# EAGLE design Screw Terminal (EAGLE 5.10)
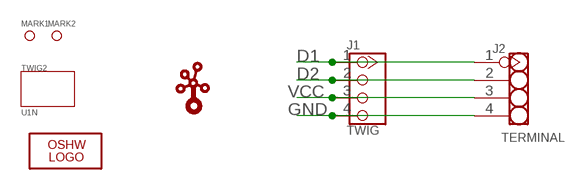
[diagram p0: schematic, sheet 1]

## Parts
J1  TWIG  TWIG-2.0-LEADED-2.0  [4P-LEADED-2.0]
J2  TERMINAL  TERMINAL-3.5X4  [4P-3.5]
LOGO1  LOGO-OSHW-FILLX0150-NT  [OSHW_FILLX150_NOTEXT]
MARK1  PAD-MARK  [ROUND-MARK-0.635]
MARK2  PAD-MARK  [ROUND-MARK-0.635]
TWIG2  U1N  TWIG-1U  [1U-DIM-W/-DRILL]
U$1  TWIGLOGOTWIGLOGO_SMALL  [TWIGLOGO_SMALL]

## Nets
D1: J1.1 J2.1
D2: J1.2 J2.2
GND: J1.4 J2.4
VCC: J1.3 J2.3

## Library data of the parts
J1 = Connector:TWIG-2.0-LEADED
J2 = Connector:TERMINAL-3.5X4
LOGO1 = Logo:LOGO-OSHW-FILL
MARK1 MARK2 = Discrete:PAD-MARK
TWIG2 = Module:TWIG
U$1 = seeedleo:TWIGLOGO

## Board
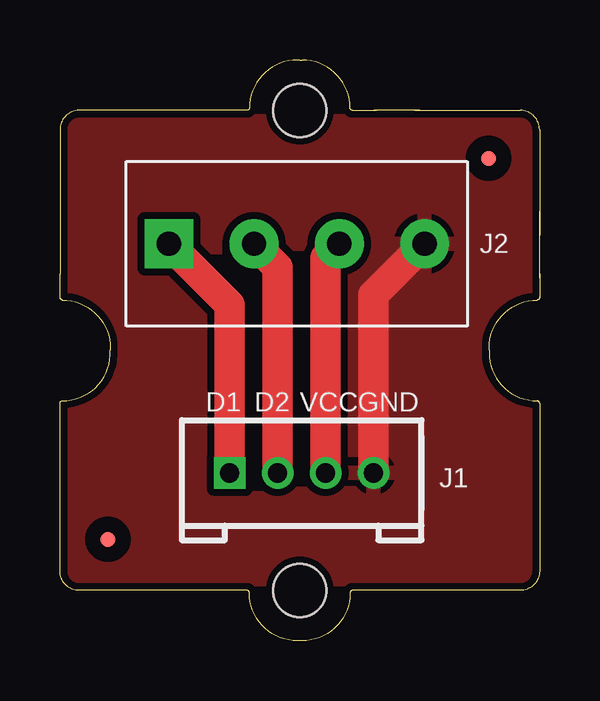
[diagram p1: board, top side]
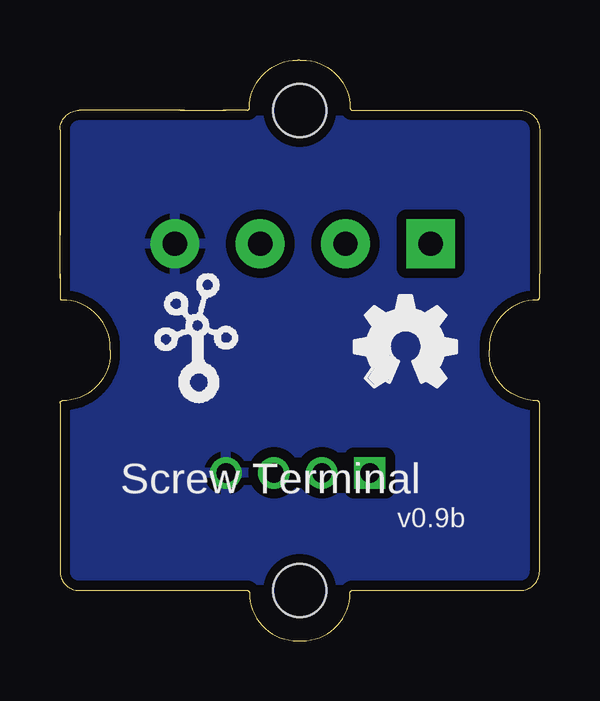
[diagram p2: board, bottom side, seen from below]

Size 20 x 24.2 mm. Coordinates in mm from the lower left corner, seen from the top.
Copper layers (1*16): Top 0.035mm / dielectric 1.5mm / Bottom 0.035mm
Design rules "SeeedStudio_rule_no_angle_090911 *": minimum track width 6mil, minimum drill 12mil, track to track 6mil, track to pad 6mil, pad to pad 6mil, via to via 6mil, smd to smd 0mil, copper to edge 10mil, drill to drill 10mil, minimum pad ring 10mil, minimum via ring 6mil, stop-mask expansion 2mil, vias tented up to drill 100mil, thermal gap 10mil

### Footprints (pad centres in the part's own frame; a part is rotated, then mirrored left to right if it is on the bottom)
4P-LEADED-2.0 = drill 0.8 pad 1.27 square: 1 -3,0 | drill 0.8 pad 1.27 round: 2 -1,0; 3 1,0; 4 3,0
4P-3.5 = drill 1.016 pad 2.032 square: 1 0,5.334 | drill 1.016 pad 2.032 round: 2 0,1.778; 3 0,-1.778; 4 0,-5.334
ROUND-MARK-0.635 = smd 0.635 x 0.635: P$1 0,0
1U-DIM-W/-DRILL = hole 2.2: 0,-10; 0,10

### Placement (x,y rotation side)
J1  10.08,6.99 0 top
J2  [4P-3.5]  9.87,16.55 90 top
LOGO1  7.71,10.58 0 bottom
MARK1  2,4.23 0 top
MARK2  17.87,20.1 0 top
TWIG2  10,12.1 180 top
U$1  16.45,9.79 0 bottom

### Tracks (layer width: path | path; a pad name or v marks a point on that pad's centre or on a via)
D1
  Top 1.27: J1.1 7.08,14.01 J2.1
D2
  Top 1.27: J1.2 9.08,15.56 J2.2
GND
  Top 1.27: J1.4 13.08,14.41 J2.4
  pour Top (isolate 0.305): 22.07,-1.11 -2.45,-1.11 -2.45,25.18 22.07,25.18
  pour Bottom (isolate 0.406): 21.94,-0.85 -2.19,-0.85 -2.19,25.18 21.94,25.18
VCC
  Top 1.27: J1.3 11.08,15.97 J2.3

### Text on the board
tPlace: D1 | D2 | VCC | GND
bPlace: Screw Terminal | v0.9b